# EAGLE design joy-button-pcb (EAGLE 8.3.2)
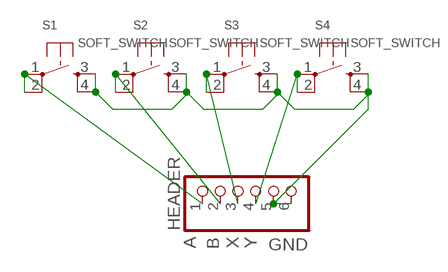
[diagram p0: schematic, sheet 1]

## Parts
HEADER  PINHD-1X6  [1X06]
S1  SOFT_SWITCH  [8MM_SWITCH]
S2  SOFT_SWITCH  [8MM_SWITCH]
S3  SOFT_SWITCH  [8MM_SWITCH]
S4  SOFT_SWITCH  [8MM_SWITCH]

## Nets
A: HEADER.1 S1.1(P) S1.2(P1)
B: HEADER.2 S2.1(P) S2.2(P1)
GND: HEADER.5 HEADER.6 S1.3(S) S1.4(S1) S2.3(S) S2.4(S1) S3.3(S) S3.4(S1) S4.3(S) S4.4(S1)
X: HEADER.3 S3.1(P) S3.2(P1)
Y: HEADER.4 S4.1(P) S4.2(P1)

## Library data of the parts
HEADER = pinhead:PINHD-1X6: PIN HEADER
S1-S4 = noe:SOFT_SWITCH

## Board
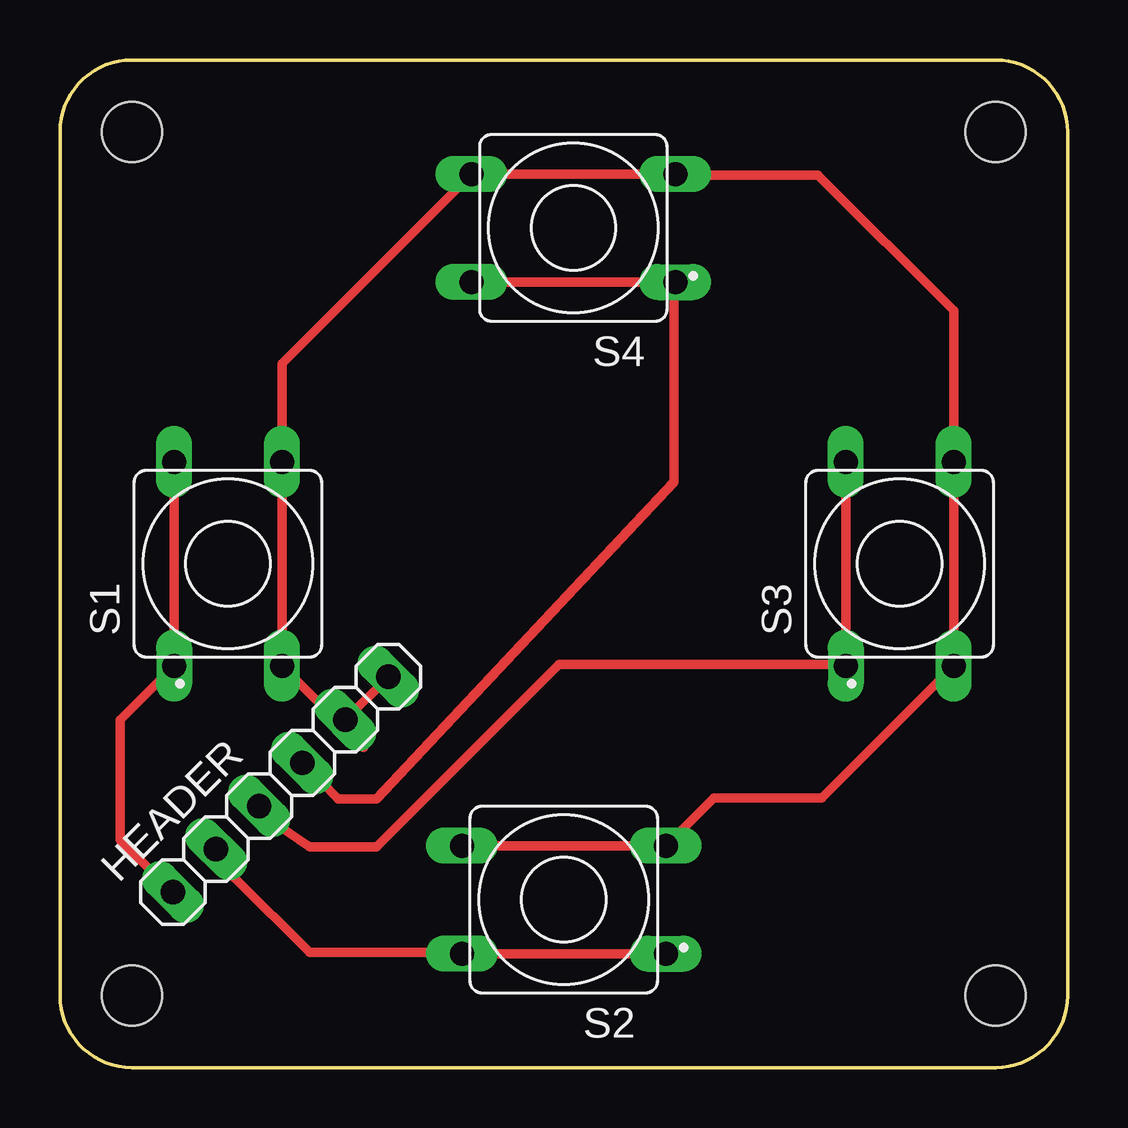
[diagram p1: board, top side]

Size 42 x 42 mm. Coordinates in mm from the lower left corner, seen from the top.
Outline: 42,39 42,3 arc-90 39,0 3,0 arc-90 0,3 0,39 arc-90 3,42 39,42 arc-90 42,39
Copper layers (1*16): Top 0.035mm / dielectric 1.5mm / Bottom 0.035mm
Design rules "default": minimum track width 6mil, minimum drill 0.35mm, track to track 6mil, track to pad 6mil, pad to pad 6mil, via to via 6mil, smd to smd 6mil, copper to edge 40mil, drill to drill 6mil, minimum pad ring 10mil, minimum via ring 8mil, stop-mask expansion 4mil, vias tented up to drill 0mil, thermal gap 10mil
Holes 2.5 mm at 3,3 39,3 3,39 39,39

### Footprints (pad centres in the part's own frame; a part is rotated, then mirrored left to right if it is on the bottom)
1X06 = drill 1.016 long: 1 -6.35,0; 2 -3.81,0; 3 -1.27,0; 4 1.27,0; 5 3.81,0; 6 6.35,0
8MM_SWITCH = drill 1 long: 1 -4.25,2.25; 2 4.25,2.25; 3 -4.25,-2.25; 4 4.25,-2.25

### Placement (x,y rotation side)
HEADER  9.2,11.8 45 top
S1  7,21 90 top
S2  21,7 180 top
S3  35,21 90 top
S4  21.4,35 180 top

### Tracks (layer width: path | path; a pad name or v marks a point on that pad's centre or on a via)
A
  Top 0.4: HEADER.1 5.54,6.46 2.5,9.5 2.5,14.5 S1.1 S1.2
B
  Top 0.4: S2.1 S2.2 16.7,4.8 10.4,4.8 7.31,7.89 HEADER.2
GND
  Top 0.4: HEADER.6 HEADER.5 12.66,13.34 S1.3 S1.4 9.25,29.35 S4.4 S4.3 25.7,37.2 31.6,37.2 37.25,31.55 S3.4 S3.3 31.75,11.25 27.25,11.25 S2.3 S2.4
X
  Top 0.4: 32.75,16.8 S3.2 | 32.75,16.8 S3.1 | HEADER.3 9.1,10.1 10.4,9.2 13.2,9.2 20.8,16.8 32.75,16.8
Y
  Top 0.4: HEADER.4 10.9,11.9 11.6,11.2 13.2,11.2 25.6,24.4 25.6,32.75 | 25.6,32.75 S4.1 | 25.6,32.75 S4.2